# Altium schematic sheet M.2 M-KEY.SchDoc: M.2 M-KEY Connector
size 431 x 279 mm; CheckedBy: Lance Bantoto; Engineer: Chealsie Bains; DocumentNumber: 19; Revision: 1; SheetNumber: 19; SheetTotal: 23
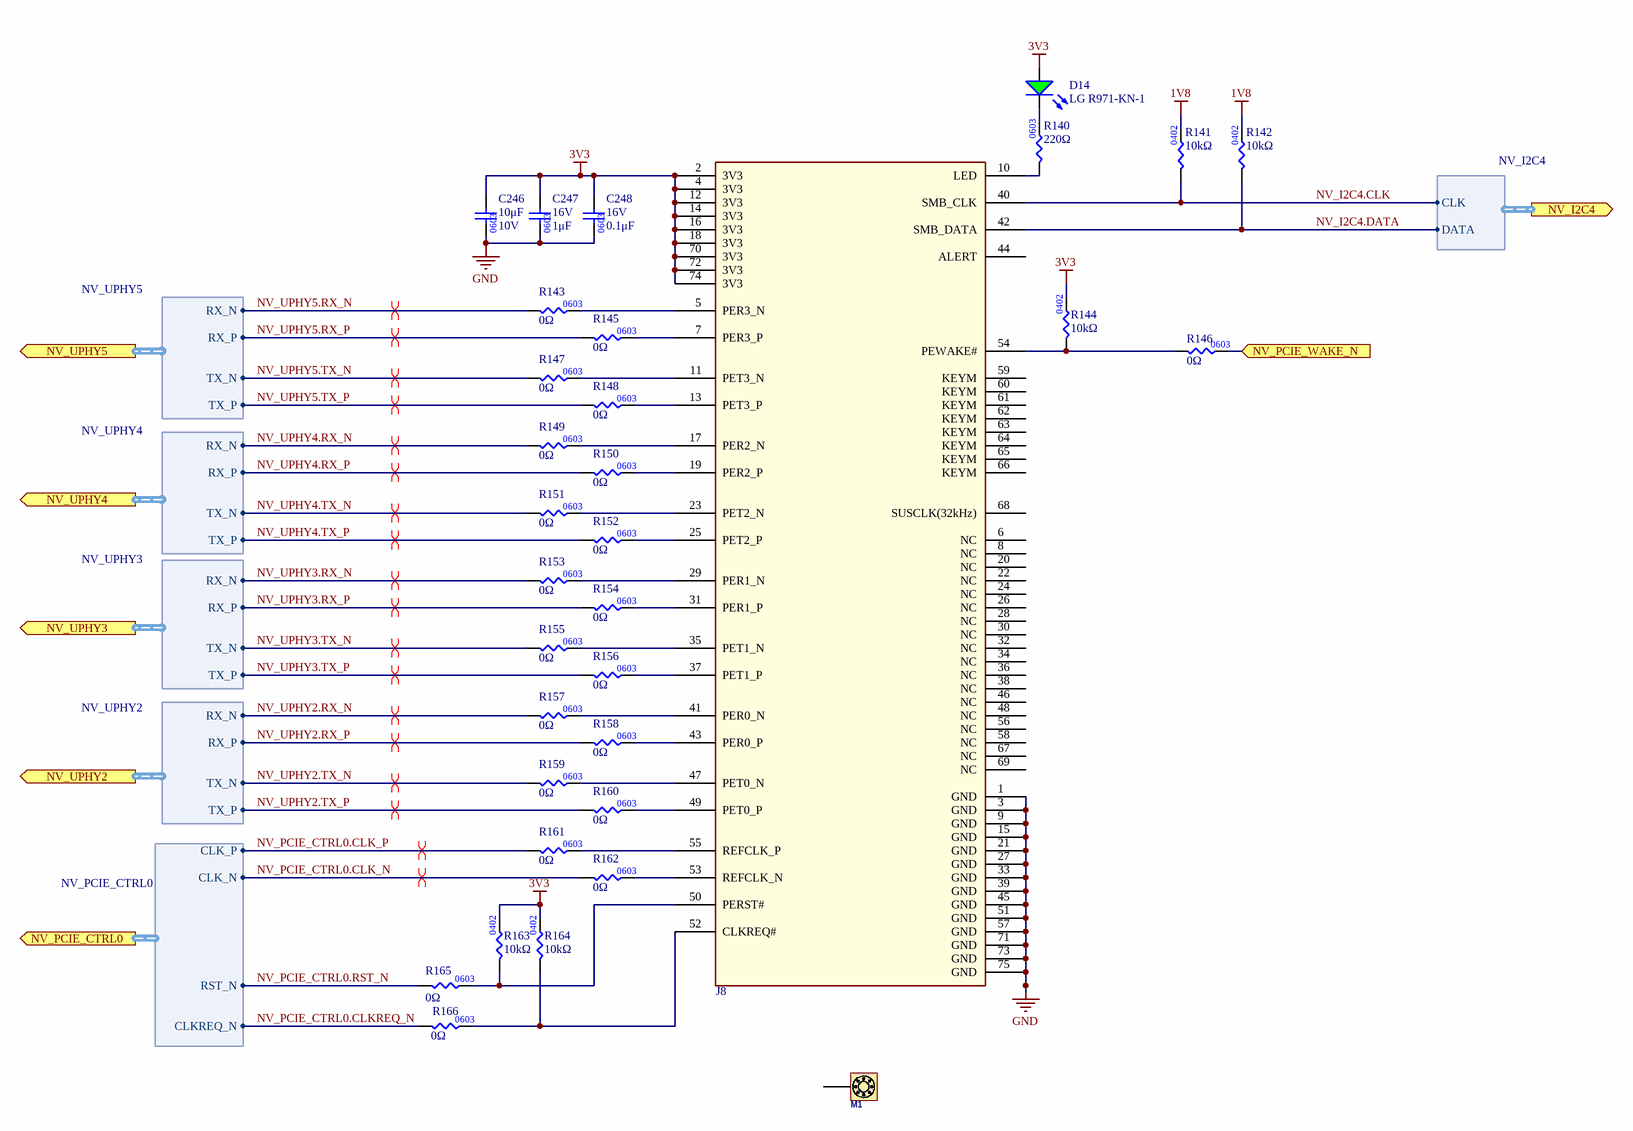
[diagram p0: M.2 M-KEY.SchDoc]

## Parts
C246  value 10μF  Voltage Rating: 10V  [CAP0603]  (hidden comment: CAP_10uF_10V_0603)
C247  value 1μF  Voltage Rating: 16V  [CAP0603]  (hidden comment: CAP_1uF_16V_0603)
C248  value 0.1μF  Voltage Rating: 16V  [CAP0603]  (hidden comment: CAP_0.1uF_16V_0603)
D14  Manufacturer Part Number 1: LG R971-KN-1  [LED_0805_GREEN]  (hidden comment: LED_GREEN)
J8  CONN M.2 FEMALE 67POS 0.020 GOLD  [TE_2199119-4]  (value not drawn)
M1  M3_SMT_STANDOFF_4-0MM  [M3_SMT_4-0MM]  (value not drawn)
R140  value 220Ω  [RES0603]  (hidden comment: RES_220Ω_0603)
R141  value 10kΩ  [RES0402]  (hidden comment: RES_10kΩ_0402_1%)
R142  value 10kΩ  [RES0402]  (hidden comment: RES_10kΩ_0402_1%)
R143  value 0Ω  [RES0603]  (hidden comment: RES_0Ω_0603)
R144  value 10kΩ  [RES0402]  (hidden comment: RES_10kΩ_0402_1%)
R145  value 0Ω  [RES0603]  (hidden comment: RES_0Ω_0603)
R146  value 0Ω  [RES0603]  (hidden comment: RES_0Ω_0603)
R147  value 0Ω  [RES0603]  (hidden comment: RES_0Ω_0603)
R148  value 0Ω  [RES0603]  (hidden comment: RES_0Ω_0603)
R149  value 0Ω  [RES0603]  (hidden comment: RES_0Ω_0603)
R150  value 0Ω  [RES0603]  (hidden comment: RES_0Ω_0603)
R151  value 0Ω  [RES0603]  (hidden comment: RES_0Ω_0603)
R152  value 0Ω  [RES0603]  (hidden comment: RES_0Ω_0603)
R153  value 0Ω  [RES0603]  (hidden comment: RES_0Ω_0603)
R154  value 0Ω  [RES0603]  (hidden comment: RES_0Ω_0603)
R155  value 0Ω  [RES0603]  (hidden comment: RES_0Ω_0603)
R156  value 0Ω  [RES0603]  (hidden comment: RES_0Ω_0603)
R157  value 0Ω  [RES0603]  (hidden comment: RES_0Ω_0603)
R158  value 0Ω  [RES0603]  (hidden comment: RES_0Ω_0603)
R159  value 0Ω  [RES0603]  (hidden comment: RES_0Ω_0603)
R160  value 0Ω  [RES0603]  (hidden comment: RES_0Ω_0603)
R161  value 0Ω  [RES0603]  (hidden comment: RES_0Ω_0603)
R162  value 0Ω  [RES0603]  (hidden comment: RES_0Ω_0603)
R163  value 10kΩ  [RES0402]  (hidden comment: RES_10kΩ_0402_1%)
R164  value 10kΩ  [RES0402]  (hidden comment: RES_10kΩ_0402_1%)
R165  value 0Ω  [RES0603]  (hidden comment: RES_0Ω_0603)
R166  value 0Ω  [RES0603]  (hidden comment: RES_0Ω_0603)

## Ports
NV_I2C4 (out, harness NV_I2C4), NV_PCIE_CTRL0 (out, harness NV_PCIE_CTRL0), NV_PCIE_WAKE_N (in), NV_UPHY2 (out, harness NV_UPHY2), NV_UPHY3 (out, harness NV_UPHY3), NV_UPHY4 (out, harness NV_UPHY4), NV_UPHY5 (out, harness NV_UPHY5)

## Harnesses
NV_UPHY5: RX_N, RX_P, TX_N, TX_P
NV_UPHY4: RX_N, RX_P, TX_N, TX_P
NV_UPHY3: RX_N, RX_P, TX_N, TX_P
NV_UPHY2: RX_N, RX_P, TX_N, TX_P
NV_PCIE_CTRL0: CLK_P, CLK_N, RST_N, CLKREQ_N
NV_I2C4: CLK, DATA

## Nets
1V8: R141.2 R142.2
3V3: C246.2 C247.2 C248.2 D14.1(A) J8.2(3V3) J8.4(3V3) J8.12(3V3) J8.14(3V3) J8.16(3V3) J8.18(3V3) J8.70(3V3) J8.72(3V3) J8.74(3V3) R144.2 R163.2 R164.2
GND: C246.1 C247.1 C248.1 J8.1(GND) J8.3(GND) J8.9(GND) J8.15(GND) J8.21(GND) J8.27(GND) J8.33(GND) J8.39(GND) J8.45(GND) J8.51(GND) J8.57(GND) J8.71(GND) J8.73(GND) J8.75(GND)
NV_I2C4.CLK: J8.40(SMB_CLK) R141.1 ; port NV_I2C4.CLK
NV_I2C4.DATA: J8.42(SMB_DATA) R142.1 ; port NV_I2C4.DATA
NV_PCIE_CTRL0.CLK_N: R162.1 ; port NV_PCIE_CTRL0.CLK_N
NV_PCIE_CTRL0.CLK_P: R161.1 ; port NV_PCIE_CTRL0.CLK_P
NV_PCIE_CTRL0.CLKREQ_N: R166.1 ; port NV_PCIE_CTRL0.CLKREQ_N
NV_PCIE_CTRL0.RST_N: R165.1 ; port NV_PCIE_CTRL0.RST_N
NV_PCIE_WAKE_N: R146.2 ; port NV_PCIE_WAKE_N
NV_UPHY2.RX_N: R157.1 ; port NV_UPHY2.RX_N
NV_UPHY2.RX_P: R158.1 ; port NV_UPHY2.RX_P
NV_UPHY2.TX_N: R159.1 ; port NV_UPHY2.TX_N
NV_UPHY2.TX_P: R160.1 ; port NV_UPHY2.TX_P
NV_UPHY3.RX_N: R153.1 ; port NV_UPHY3.RX_N
NV_UPHY3.RX_P: R154.1 ; port NV_UPHY3.RX_P
NV_UPHY3.TX_N: R155.1 ; port NV_UPHY3.TX_N
NV_UPHY3.TX_P: R156.1 ; port NV_UPHY3.TX_P
NV_UPHY4.RX_N: R149.1 ; port NV_UPHY4.RX_N
NV_UPHY4.RX_P: R150.1 ; port NV_UPHY4.RX_P
NV_UPHY4.TX_N: R151.1 ; port NV_UPHY4.TX_N
NV_UPHY4.TX_P: R152.1 ; port NV_UPHY4.TX_P
NV_UPHY5.RX_N: R143.1 ; port NV_UPHY5.RX_N
NV_UPHY5.RX_P: R145.1 ; port NV_UPHY5.RX_P
NV_UPHY5.TX_N: R147.1 ; port NV_UPHY5.TX_N
NV_UPHY5.TX_P: R148.1 ; port NV_UPHY5.TX_P
NetD14_2: D14.2(K) R140.2
NetJ8_5: J8.5(PER3_N) R143.2
NetJ8_7: J8.7(PER3_P) R145.2
NetJ8_10: J8.10(LED) R140.1
NetJ8_11: J8.11(PET3_N) R147.2
NetJ8_13: J8.13(PET3_P) R148.2
NetJ8_17: J8.17(PER2_N) R149.2
NetJ8_19: J8.19(PER2_P) R150.2
NetJ8_23: J8.23(PET2_N) R151.2
NetJ8_25: J8.25(PET2_P) R152.2
NetJ8_29: J8.29(PER1_N) R153.2
NetJ8_31: J8.31(PER1_P) R154.2
NetJ8_35: J8.35(PET1_N) R155.2
NetJ8_37: J8.37(PET1_P) R156.2
NetJ8_41: J8.41(PER0_N) R157.2
NetJ8_43: J8.43(PER0_P) R158.2
NetJ8_47: J8.47(PET0_N) R159.2
NetJ8_49: J8.49(PET0_P) R160.2
NetJ8_50: J8.50(PERST#) R163.1 R165.2
NetJ8_52: J8.52(CLKREQ#) R164.1 R166.2
NetJ8_53: J8.53(REFCLK_N) R162.2
NetJ8_54: J8.54(PEWAKE#) R144.1 R146.1
NetJ8_55: J8.55(REFCLK_P) R161.2

Not connected (* = marked no-connect by the designer): J8 6(NC) 8(NC) 20(NC) 22(NC) 24(NC) 26(NC) 28(NC) 30(NC) 32(NC) 34(NC) 36(NC) 38(NC) 44(ALERT) 46(NC) 48(NC) 56(NC) 58(NC) 59(KEYM) 60(KEYM) 61(KEYM) 62(KEYM) 63(KEYM) 64(KEYM) 65(KEYM) 66(KEYM) 67(NC) 68(SUSCLK(32kHz)) 69(NC); M1 0

## Layout directives
differential pair: NV_PCIE_CTRL0.CLK_N, NV_PCIE_CTRL0.CLK_P, NV_UPHY2.RX_N, NV_UPHY2.RX_P, NV_UPHY2.TX_N, NV_UPHY2.TX_P, NV_UPHY3.RX_N, NV_UPHY3.RX_P, NV_UPHY3.TX_N, NV_UPHY3.TX_P, NV_UPHY4.RX_N, NV_UPHY4.RX_P, NV_UPHY4.TX_N, NV_UPHY4.TX_P, NV_UPHY5.RX_N, NV_UPHY5.RX_P, NV_UPHY5.TX_N, NV_UPHY5.TX_P

## Notes on the sheet
- University of Waterloo Robotics Team
- 200 University Ave W
- REV
- PROJECT
- Waterloo, Ontario, Canada
- N2L 3G1
- DOCUMENT
- ENGINEER
- REVIEWER
- MODIFIED
- SHEET
- OF
- (in symbol CAP_10uF_10V_0603) 0603

## Library data of the parts
C246 = CAP_10uF_10V_0603: CAP CER 10UF 10V X5R 0603; Manufacturer Part Number 1: CC0603MRX5R6BB106; Manufacturer 1: Yageo; Supplier Part Number 1: 311-1817-1-ND; Supplier 1: Digi-Key; Dielectric: X5R
C247 = CAP_1uF_16V_0603: CAP CER 1UF 16V Y5V 0603; Manufacturer 1: Yageo; Manufacturer Part Number 1: CC0603ZRY5V7BB105; Package/Footprint: 0603; Supplier Part Number 1: 311-1372-1-ND; Supplier 1: Digi-Key; Mounting Type: SMD; Dielectric: Y5V
C248 = CAP_0.1uF_16V_0603: CAP CER 0.1UF 16V X7R 0603; Manufacturer Part Number 1: CC0603KRX7R7BB104; Manufacturer 1: Yageo; Package/Footprint: 0603; Supplier Part Number 1: 311-1088-1-ND; Supplier 1: Digi-Key; Dielectric: X7R
D14 = LED_GREEN: LED GREEN DIFFUSED 0805 SMD; Manufacturer 1: OSRAM; Forward Voltage Drop: 2.2V; Package/Footprint: 0805; Supplier Part Number 1: 475-1410-1-ND; Supplier 1: Digi-Key; Mounting Type: SMD
J8 = CONN M.2 FEMALE 67POS 0.020 GOLD: Card Edge Connector, 67 Contact(s), 2 Row(s), Female, Right Angle, 0.019 inch Pitch, Locking, Black Insulator, Socket; Manufacturer: TE Connectivity; Manufacturer Part Number: 1-2199119-5; Supplier 1: Digi-Key; Supplier Part Number 1: A115902CT-ND; RoHS: Yes; Category: Card Edge Connectors; Stock 1: 13599; Pricing 1: 1=1.28000, 10=1.12400, 25=1.05760, 50=1.01340, 100=0.96940, 250=0.88128, 500=0.79314 (USD); Connector Type: CARD EDGE CONNECTOR; REACH SVHC: Yes; RoHS Compliant: Yes; ComponentLink1URL: https://datasheet.ciiva.com:443/pdfs/VipMasterIC/IC/TYEL/TYEL-S-A0008646546/TYEL-S-A0008667243-1.pdf?src-supplier=IHS+Markit; ComponentLink1Description: https://datasheet.ciiva.com:443/pdfs/VipMasterIC/IC/TYEL/TYEL-S-A0008646546/TYEL-S-A0008667243-1.pdf?src-supplier=IHS+Markit; ComponentLink2URL: https://datasheet.ciiva.com/18495/eng-cd-2199119-c-c-2199119-c-18495963.pdf?src-supplier=Digi-Key; ComponentLink2Description: https://datasheet.ciiva.com/18495/eng-cd-2199119-c-c-2199119-c-18495963.pdf?src-supplier=Digi-Key; ComponentLink3URL: https://datasheet.ciiva.com/18495/eng-cd-2199119-c-c-2199119-c-18495964.pdf?src-supplier=Digi-Key; ComponentLink3Description: https://datasheet.ciiva.com/18495/eng-cd-2199119-c-c-2199119-c-18495964.pdf?src-supplier=Digi-Key; ComponentLink4URL: https://datasheet.ciiva.com/18495/eng-cd-2199119-c-c-2199119-c-18495965.pdf?src-supplier=Digi-Key; ComponentLink4Description: https://datasheet.ciiva.com/18495/eng-cd-2199119-c-c-2199119-c-18495965.pdf?src-supplier=Digi-Key
M1 = M3_SMT_STANDOFF_4-0MM: ROUND STANDOFF M3X0.5 STEEL 4MM; Manufacturer 1: Würth Elektronik; Manufacturer Part Number 1: 9774040360R; Supplier 1: Digi-Key; Supplier Part Number 1: 732-5271-1-ND
R140 = RES_220Ω_0603_5%: RES 220 OHM 5% 1/10W 0603; Manufacturer 1: Yageo; Manufacturer Part Number 1: AC0603JR-07220RL; Package/Footprint: 0603; Supplier Part Number 1: YAG3652CT-ND; Supplier 1: Digi-Key
R141 R142 = RES_10kΩ_0402_1%: RES SMD 10K OHM 1% 1/16W 0402; Manufacturer 1: Vishay Dale; Manufacturer Part Number 1: CRCW040210K0FKTD; Package/Footprint: 0402; Power: 0.063W, 1/16W; Supplier Part Number 1: 541-2955-1-ND; Supplier 1: Digi-Key; Mounting Type: SMD; Tolerance: 1%
R143 R145 R147-R162 = RES_0Ω_0603: RES 0 OHM JUMPER 1/10W 0603; Manufacturer 1: Yageo; Manufacturer Part Number 1: RC0603JR-070RL; Supplier Part Number 1: 311-0.0GRCT-ND; Supplier 1: Digi-Key; Mounting Type: SMD; Package: 0603
R144 R163 R164 = RES_10kΩ_0402_1%: RES SMD 10K OHM 1% 1/16W 0402; Manufacturer Part Number 1: CRCW040210K0FKTD; Manufacturer 1: Vishay Dale; Power: 0.063W, 1/16W; Package/Footprint: 0402; Supplier 1: Digi-Key; Supplier Part Number 1: 541-2955-1-ND; Mounting Type: SMD; Tolerance: 1%
R146 R165 R166 = RES_0Ω_0603: RES 0 OHM JUMPER 1/10W 0603; Manufacturer 1: Yageo; Manufacturer Part Number 1: RC0603JR-070RL; Package/Footprint: 0603; Supplier Part Number 1: 311-0.0GRCT-ND; Supplier 1: Digi-Key; Mounting Type: SMD